# EAGLE design 5xLED (EAGLE 7.4.0)
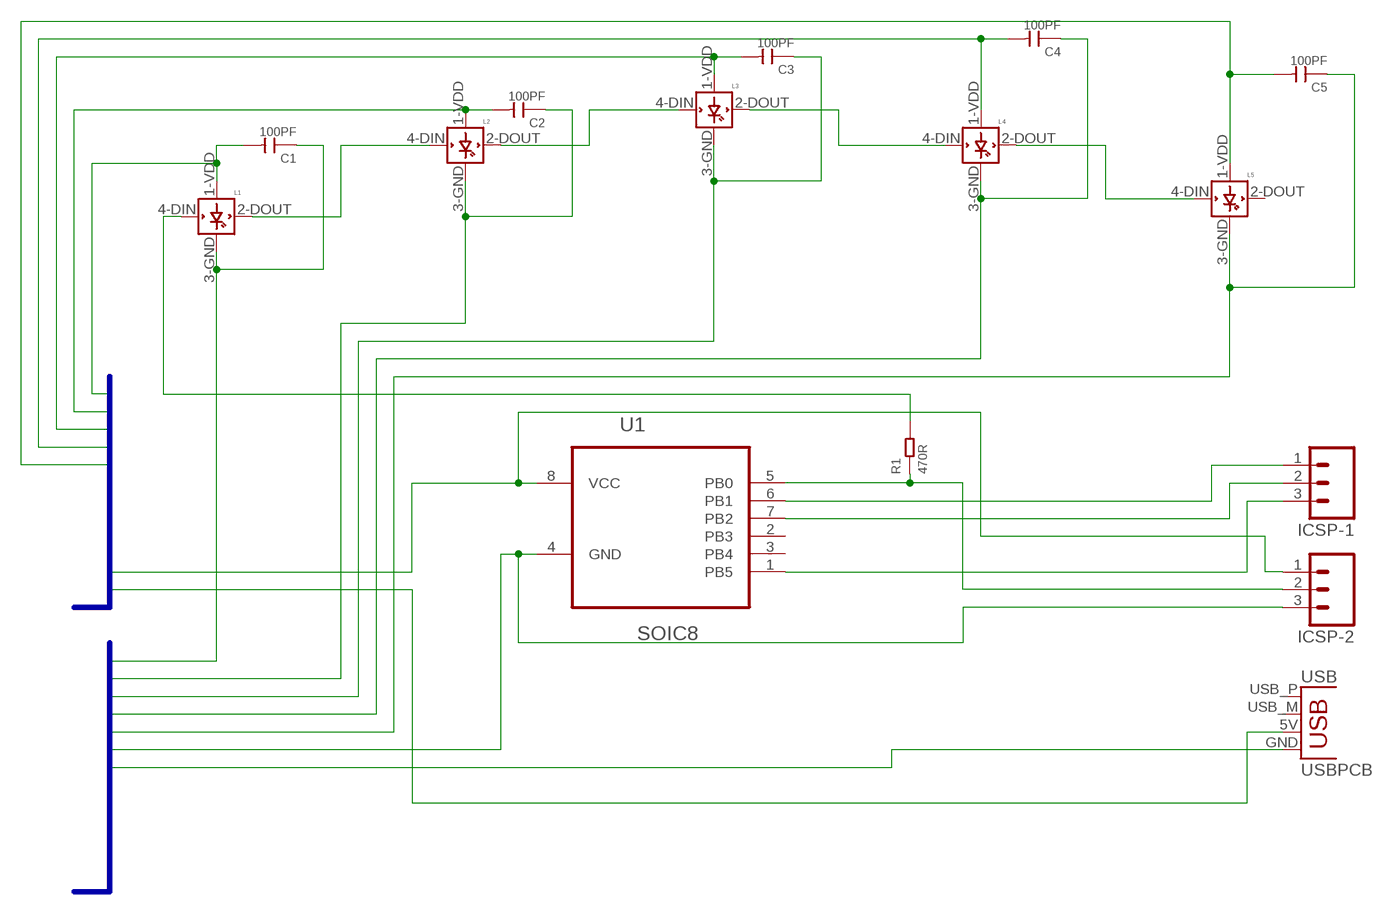
[diagram p0: schematic, sheet 1]

## Parts
C1  100PF  CERAMIC-100PF-50V-5%-NPO(0805)  [C0805]
C2  100PF  CERAMIC-100PF-50V-5%-NPO(0805)  [C0805]
C3  100PF  CERAMIC-100PF-50V-5%-NPO(0805)  [C0805]
C4  100PF  CERAMIC-100PF-50V-5%-NPO(0805)  [C0805]
C5  100PF  CERAMIC-100PF-50V-5%-NPO(0805)  [C0805]
ICSP-1  M03SMD_RA_MALE  [1X03_SMD_RA_MALE]
ICSP-2  M03SMD_RA_MALE  [1X03_SMD_RA_MALE]
L1  WS2812B  [WS2812B]
L2  WS2812B  [WS2812B]
L3  WS2812B  [WS2812B]
L4  WS2812B  [WS2812B]
L5  WS2812B  [WS2812B]
R1  470R  SMD-RES-470R-1%-1/8W(0805)  [R0805]
U1  SOIC8  MCU-ATTINY85-20SU(SOIC8)  [SOIC8-1.27-5.3X5.3MM]
USB  USBPCB  [USB-A-PCB]

## Nets
GND: C1.1 C2.1 C3.1 C4.1 C5.1 ICSP-2.3 L1.3-GND(GND) L2.3-GND(GND) L3.3-GND(GND) L4.3-GND(GND) L5.3-GND(GND) U1.4(GND) USB.GND
N$1: L1.2-DOUT(DOUT) L2.4-DIN(DIN)
N$2: L2.2-DOUT(DOUT) L3.4-DIN(DIN)
N$3: L3.2-DOUT(DOUT) L4.4-DIN(DIN)
N$4: L4.2-DOUT(DOUT) L5.4-DIN(DIN)
N$6: ICSP-2.2 R1.1 U1.5(PB0)
N$10: ICSP-1.1 U1.6(PB1)
N$11: ICSP-1.2 U1.7(PB2)
N$12: ICSP-1.3 U1.1(PB5)
N$14: L1.4-DIN(DIN) R1.2
VCC: C1.2 C2.2 C3.2 C4.2 C5.2 ICSP-2.1 L1.1-VDD(VDD) L2.1-VDD(VDD) L3.1-VDD(VDD) L4.1-VDD(VDD) L5.1-VDD(VDD) U1.8(VCC) USB.5V(VBUS)
Unconnected: L5.2-DOUT(DOUT) U1.2(PB3) U1.3(PB4) USB.USB_M(D-) USB.USB_P(D+)

## Buses
VCC
GND

## Library data of the parts
C1-C5 = Seeed-OPL-Capacitor:CERAMIC-100PF-50V-5%-NPO(0805): 302010153
ICSP-1 ICSP-2 = SparkFun-Connectors:M03: Header 3 Standard 3-pin 0.1" header. Use with straight break away headers (SKU : PRT-00116), right angle break away headers (PRT-00553), swiss pins (PRT-00743), machine pins (PRT-00117), and female headers (PRT-00115). Molex polarized connector foot print use with SKU : PRT-08232 with associated crimp pins and housings.; PROD_ID: CONN-10925
L1-L5 = adafruit:WS2812B
R1 = Seeed-OPL-Resistor:SMD-RES-470R-1%-1/8W(0805): 301010367; MPN: RC0805FR-07470RL
U1 = Seeed-OPL-ic:MCU-ATTINY85-20SU(SOIC8): 310010108; MPN: ATTINY85-20SU; VALUE: ATTINY85-20SU-SOIC8
USB = SparkFun-Connectors:USB: USB Connectors USB-B-PTH is fully proven SKU : PRT-00139/CONN-08278 USB-miniB is fully proven SKU : PRT-00587 USB-A-PCB is untested. USB-A-H is throughly reviewed, but untested. Spark Fun Electronics SKU : PRT-00437 USB-B-SMT is throughly reviewed, but untested. Needs silkscreen touching up. USB-A-S has not been used/tested USB-MB-H has not been used/tested USB-MICROB has been used. CONN-09505

## Board
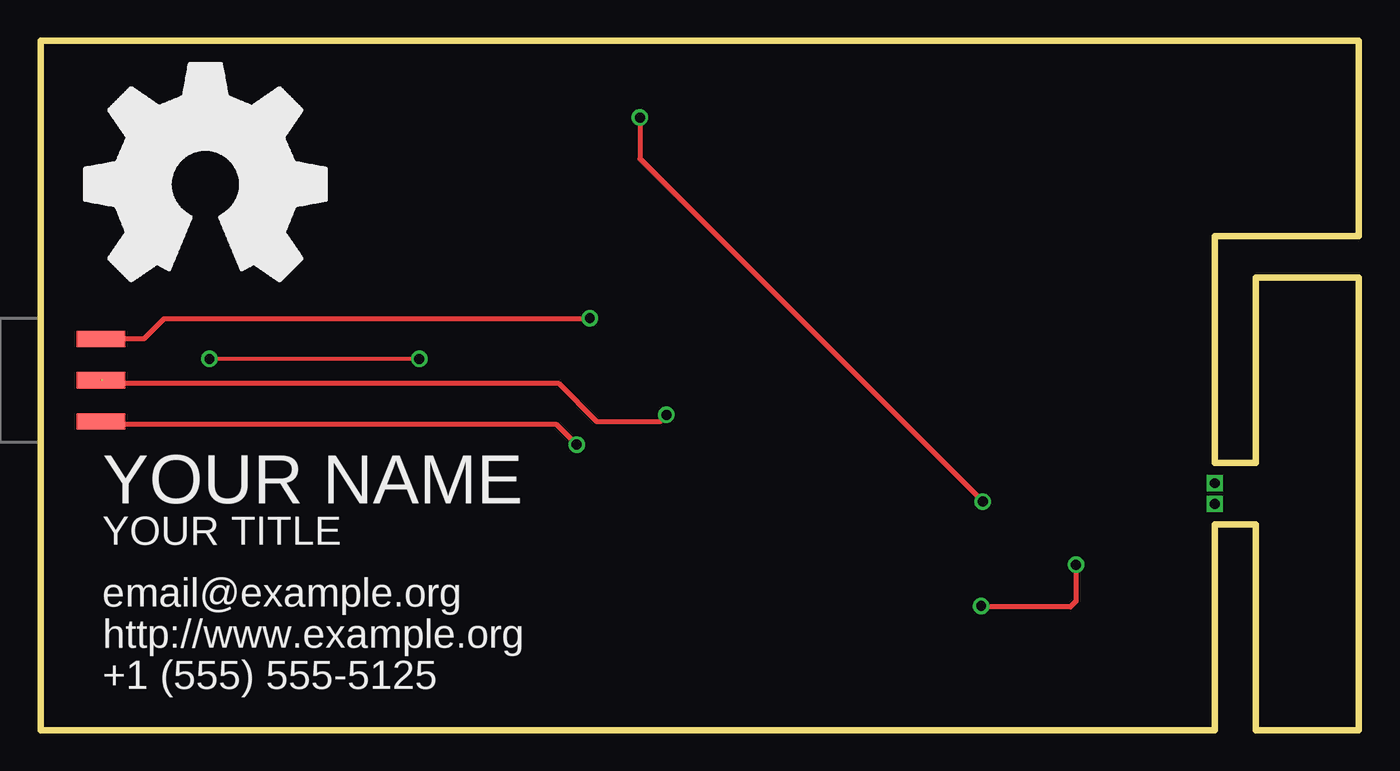
[diagram p1: board, top side]
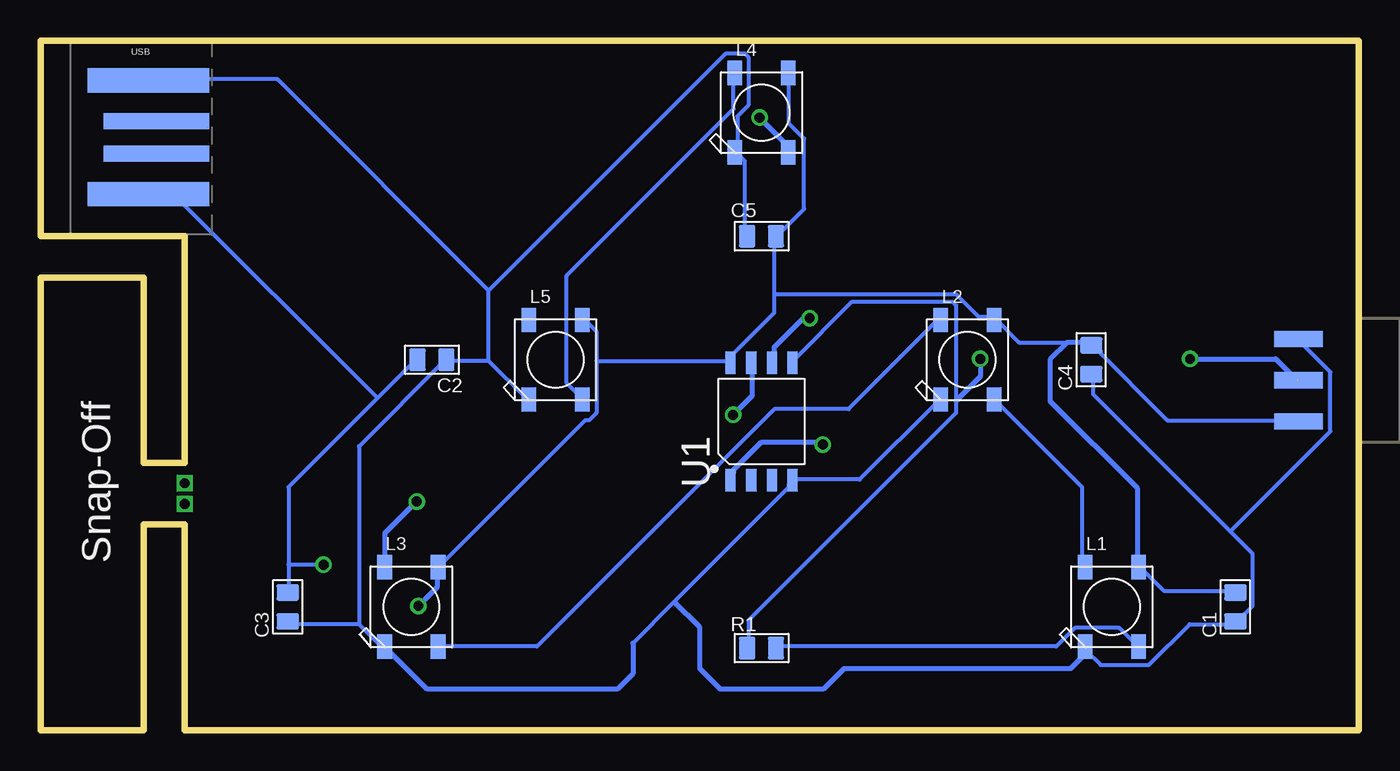
[diagram p2: board, bottom side, seen from below]

Size 81.28 x 42.55 mm. Coordinates in mm from the lower left corner, seen from the top.
Outline: 81.28,42.55 0,42.55 0,0 72.39,0 72.39,12.7 74.93,12.7 74.93,0 81.28,0 81.28,27.94 74.93,27.94 74.93,16.51 72.39,16.51 72.39,30.48 81.28,30.48 81.28,42.55
Copper layers (1*16): Top 0.035mm / dielectric 1.5mm / Bottom 0.035mm
Design rules "default": minimum track width 10mil, minimum drill 24mil, track to track 8mil, track to pad 8mil, pad to pad 8mil, via to via 8mil, smd to smd 8mil, copper to edge 40mil, drill to drill 8mil, minimum pad ring 10mil, minimum via ring 8mil, stop-mask expansion 4mil, vias tented up to drill 0mil, thermal gap 10mil

### Footprints (pad centres in the part's own frame; a part is rotated, then mirrored left to right if it is on the bottom)
C0805 = smd 1.397 x 1.016: 1 0,0.889; 2 0,-0.889
1X03_SMD_RA_MALE = smd 1 x 3: 1 -2.54,5; 2 0,5; 3 2.54,5
WS2812B = smd 1.5 x 0.9: 1-VDD 2.45,-1.65; 2-DOUT 2.45,1.65; 3-GND -2.45,1.65; 4-DIN -2.45,-1.65
R0805 = smd 1.397 x 1.016: 1 0,0.889; 2 0,-0.889
SOIC8-1.27-5.3X5.3MM = smd 0.62 x 1.4: 1 -1.905,-3.623; 2 -0.635,-3.623; 3 0.635,-3.623; 4 1.905,-3.623; 5 1.905,3.623; 6 0.635,3.623; 7 -0.635,3.623; 8 -1.905,3.623
USB-A-PCB = smd 7.5 x 1.5: 5V -0.2,-3.5; GND -0.2,3.5 | smd 6.5 x 1: USB_M 0.3,-1; USB_P 0.3,1

### Placement (x,y rotation side)
C1  7.62,7.62 180 bottom
C2  57.15,22.86 270 bottom
C3  66.04,7.62 180 bottom
C4  16.51,22.86 180 bottom
C5  36.83,30.48 90 bottom
ICSP-1  -1.27,21.59 270 top
ICSP-2  -1.27,21.59 90 bottom
L1  15.24,7.62 90 bottom
L2  24.13,22.86 90 bottom
L3  58.42,7.62 90 bottom
L4  36.83,38.1 90 bottom
L5  49.53,22.86 90 bottom
R1  36.83,5.08 90 bottom
U1  36.83,19.05 0 bottom
USB  74.42,36.58 0 bottom

### Tracks (layer width: path | path; a pad name or v marks a point on that pad's centre or on a via)
GND
  Bottom 0.254: 7.92,12.27 6.55,10.9 6.55,7.7 7.47,6.78 C1.1 7.7,6.55 10.44,6.55 12.95,4.04 15.93,4.04 16.84,4.95 L1.3-GND 17.07,4.95 | 7.92,12.27 16.38,20.73 16.38,21.87 C4.1 | 7.92,12.27 1.75,18.44 1.75,22.1 3.58,23.93 ICSP-2.3 | L2.3-GND 25.98,20.27 30.79,15.47 34.9,15.47 U1.4 35.13,15.24 35.13,15.01 42.22,7.92 44.76,5.39 | 61.65,6.55 65.99,6.55 C3.1 | 61.65,6.55 60.27,5.18 L3.3-GND 60.05,4.95 | C5.1 37.87,30.56 37.87,35.13 38.33,35.59 L4.3-GND 38.33,35.81 38.33,37.87 37.64,38.56 37.64,41.53 37.87,41.76 39.01,41.76 53.65,27.13 | 53.65,22.78 56.16,22.78 C2.1 56.39,22.78 61.65,17.53 61.65,6.55 | 53.65,22.78 51.36,20.5 L5.3-GND | 53.65,22.78 53.65,27.13 | 53.65,27.13 66.67,40.16 74.91,40.16 USB.GND
  Bottom 0.305: 17.07,4.95 17.07,4.52 17.78,3.81 31.75,3.81 33.02,2.54 39.37,2.54 40.64,3.81 40.64,6.35 42.22,7.92 | 44.76,5.39 44.76,3.5 45.72,2.54 57.44,2.54 L3.3-GND
N$1
  Bottom 0.254: L1.2-DOUT 17.07,10.21 17.07,15.01 22.33,20.27 L2.4-DIN
N$2
  Bottom 0.254: L3.4-DIN 56.62,5.18 50.67,5.18 36.04,19.81 31.47,19.81 25.98,25.3 L2.2-DOUT
N$3  (via drill 0.61)
  Top 0.305: v36.96,37.8 36.96,35.26 v58.09,14.12
  Bottom 0.254: 35.36,35.59 L4.4-DIN | 60.05,10.21 L3.2-DOUT
  Bottom 0.305: 60.05,10.21 60.05,12.17 v58.09,14.12 | 35.36,35.59 35.36,36.2 v36.96,37.8
N$4
  Bottom 0.254: L4.2-DOUT 38.56,40.39 38.56,38.33 48.84,28.04 48.84,21.41 47.93,20.5 L5.4-DIN
N$6  (via drill 0.61)  (1 unrouted)
  Top 0.254: v23.34,22.91 v10.41,22.91
  Bottom 0.254: R1.1 37.64,5.18 37.64,6.78 24.84,19.58 24.84,20.32 24.84,26.21 25.07,26.44 31.24,26.44 34.9,22.78 U1.5 | 3.81,21.64 ICSP-2.2
  Bottom 0.305: v10.41,22.91 5.13,22.91 3.81,21.59 | v23.34,22.91 23.34,21.82 24.84,20.32
N$9  (via drill 0.6)
  other vias: 72.39,15.24
N$10  (via drill 0.61)
  Top 0.254: 3.81,24.15 ICSP-1.1
  Top 0.305: 3.81,24.15 6.37,24.15 7.62,25.4 33.83,25.4 v33.86,25.43
  Bottom 0.254: 36.04,22.78 U1.6
  Bottom 0.305: 36.04,22.78 36.04,23.65 34.29,25.4 33.88,25.4 v33.86,25.43
N$11  (via drill 0.61)
  Top 0.254: 3.81,21.41 ICSP-1.2
  Top 0.305: 3.81,21.41 31.93,21.41 34.29,19.05 38.18,19.05 v38.58,19.46
  Bottom 0.254: 37.41,22.1 37.41,22.55 U1.7
  Bottom 0.305: 37.41,22.1 37.41,20.62 v38.58,19.46
N$12  (via drill 0.61)
  Top 0.254: 3.81,18.9 ICSP-1.3
  Top 0.305: 3.81,18.9 31.78,18.9 v33.05,17.63
  Bottom 0.254: 38.56,15.93 38.56,15.47 U1.1
  Bottom 0.305: 38.56,15.93 38.56,16.05 36.83,17.78 33.2,17.78 v33.05,17.63
N$13  (via drill 0.6)
  other vias: 72.39,13.97
N$14
  Bottom 0.254: R1.2 35.81,5.18 18.67,5.18 17.53,6.33 14.78,6.33 13.64,5.18 L1.4-DIN
VCC  (via drill 0.61)
  Top 0.305: v63.83,10.21 63.83,7.95 63.5,7.62 58.04,7.62 v57.99,7.67
  Bottom 0.254: 65.99,10.21 65.99,15.01 60.5,20.5 | 65.99,10.21 65.99,8.61 C3.2 | 60.5,20.5 58.22,22.78 C2.2 | 60.5,20.5 73.3,33.3 74.91,33.3 USB.5V | C1.2 7.7,8.61 12.04,8.61 13.41,9.98 L1.1-VDD 13.64,10.21 | ICSP-2.1 3.81,19.13 11.81,19.13 16.38,23.7 C4.2 16.61,23.93 20.95,23.93 22.33,25.3 L2.1-VDD 22.55,25.53 23.47,25.53 24.84,26.9 36.04,26.9 | 36.04,26.9 36.04,25.76 38.56,23.24 38.56,22.78 U1.8 38.79,22.78 47.02,22.78 | 36.04,26.9 36.04,30.33 C5.2 35.81,30.56 34.21,32.16 34.21,36.5 35.13,37.41 35.13,40.39 L4.1-VDD | 47.02,22.78 47.02,24.61 47.7,25.3 L5.1-VDD | 47.02,22.78 47.02,19.58 47.47,19.13 47.7,19.13 56.62,10.21 L3.1-VDD 56.85,10.21 | v63.83,10.21 65.99,10.21
  Bottom 0.305: 56.85,10.21 56.85,8.81 v57.99,7.67 | 13.64,10.21 13.64,14.91 19.05,20.32 19.05,22.86 17.98,23.93 16.61,23.93

### Text on the board
tPlace: YOUR NAME | YOUR TITLE | email@example.org | http://www.example.org | +1 (555) 555-5125
bPlace: Snap-Off